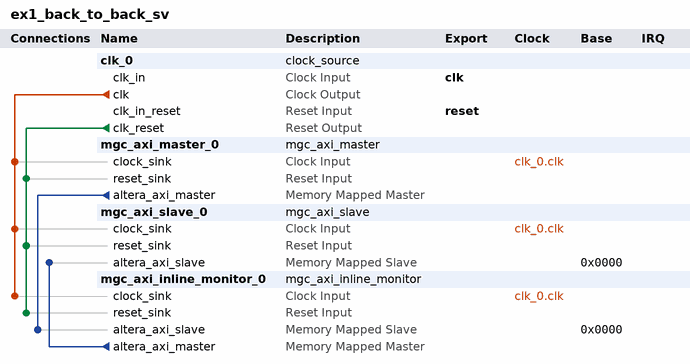
[diagram p0: system contents]
# Platform Designer (Qsys) system ex1_back_to_back_sv, Cyclone IV GX Unknown
# Parameters at their usual value, and those the tool derives, are not listed.
package require -exact qsys 13.1
create_system ex1_back_to_back_sv
set_project_property DEVICE_FAMILY {Cyclone IV GX}
set_project_property DEVICE Unknown

add_instance clk_0 clock_source 13.1
set_instance_parameter_value clk_0 clockFrequency 50000000

add_instance mgc_axi_master_0 mgc_axi_master 100.99.98.97
set_instance_parameter_value mgc_axi_master_0 AXI_ADDRESS_WIDTH 32
set_instance_parameter_value mgc_axi_master_0 AXI_RDATA_WIDTH 32
set_instance_parameter_value mgc_axi_master_0 AXI_WDATA_WIDTH 32
set_instance_parameter_value mgc_axi_master_0 AXI_ID_WIDTH 18
set_instance_parameter_value mgc_axi_master_0 index 0

add_instance mgc_axi_slave_0 mgc_axi_slave 100.99.98.97
set_instance_parameter_value mgc_axi_slave_0 AXI_ADDRESS_WIDTH 32
set_instance_parameter_value mgc_axi_slave_0 AXI_RDATA_WIDTH 32
set_instance_parameter_value mgc_axi_slave_0 AXI_WDATA_WIDTH 32
set_instance_parameter_value mgc_axi_slave_0 AXI_ID_WIDTH 18
set_instance_parameter_value mgc_axi_slave_0 index 0

add_instance mgc_axi_inline_monitor_0 mgc_axi_inline_monitor 100.99.98.97
set_instance_parameter_value mgc_axi_inline_monitor_0 AXI_ADDRESS_WIDTH 32
set_instance_parameter_value mgc_axi_inline_monitor_0 AXI_RDATA_WIDTH 32
set_instance_parameter_value mgc_axi_inline_monitor_0 AXI_WDATA_WIDTH 32
set_instance_parameter_value mgc_axi_inline_monitor_0 AXI_ID_WIDTH 18
set_instance_parameter_value mgc_axi_inline_monitor_0 index 0

# connections
add_connection clk_0.clk mgc_axi_inline_monitor_0.clock_sink clock
add_connection clk_0.clk mgc_axi_master_0.clock_sink clock
add_connection clk_0.clk mgc_axi_slave_0.clock_sink clock
add_connection clk_0.clk_reset mgc_axi_inline_monitor_0.reset_sink reset
add_connection clk_0.clk_reset mgc_axi_master_0.reset_sink reset
add_connection clk_0.clk_reset mgc_axi_slave_0.reset_sink reset
add_connection mgc_axi_inline_monitor_0.altera_axi_master mgc_axi_slave_0.altera_axi_slave avalon
set_connection_parameter_value mgc_axi_inline_monitor_0.altera_axi_master/mgc_axi_slave_0.altera_axi_slave baseAddress 0x0000
add_connection mgc_axi_master_0.altera_axi_master mgc_axi_inline_monitor_0.altera_axi_slave avalon
set_connection_parameter_value mgc_axi_master_0.altera_axi_master/mgc_axi_inline_monitor_0.altera_axi_slave baseAddress 0x0000

# exported interfaces
add_interface clk clock sink
set_interface_property clk EXPORT_OF clk_0.clk_in
add_interface reset reset sink
set_interface_property reset EXPORT_OF clk_0.clk_in_reset

set_interconnect_requirement {$system} qsys_mm.clockCrossingAdapter HANDSHAKE
set_interconnect_requirement {$system} qsys_mm.maxAdditionalLatency 1

save_system ex1_back_to_back_sv.qsys
